# Altium schematic sheet SD_Card.SchDoc
size A4
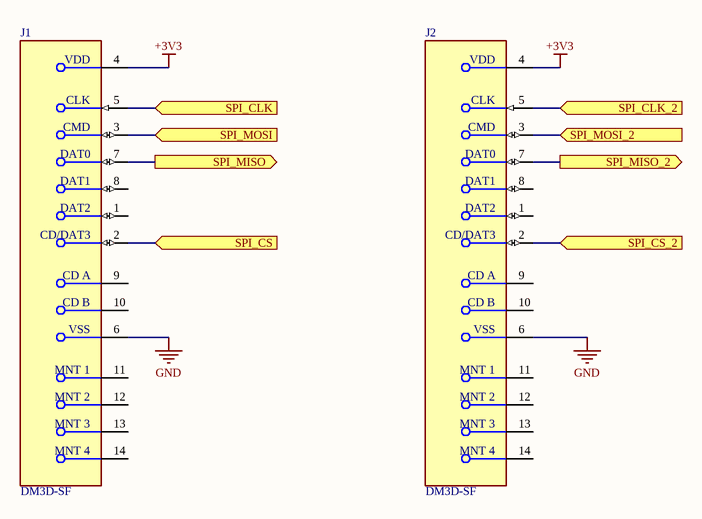
[diagram p0: SD_Card.SchDoc]

## Parts
J1  DM3D-SF  [FP-DM3D-SF-MFG]
J2  DM3D-SF  [FP-DM3D-SF-MFG]

## Ports
SPI_CLK (in), SPI_CLK_2 (in), SPI_CS (in), SPI_CS_2 (in), SPI_MISO (out), SPI_MISO_2 (out), SPI_MOSI (in), SPI_MOSI_2 (in)

## Nets
+3V3: J1.4(VDD) J2.4(VDD)
GND: J1.6(VSS) J2.6(VSS)
SPI_CLK: J1.5(CLK) ; port SPI_CLK
SPI_CLK_2: J2.5(CLK) ; port SPI_CLK_2
SPI_CS: J1.2(CD/DAT3) ; port SPI_CS
SPI_CS_2: J2.2(CD/DAT3) ; port SPI_CS_2
SPI_MISO: J1.7(DAT0) ; port SPI_MISO
SPI_MISO_2: J2.7(DAT0) ; port SPI_MISO_2
SPI_MOSI: J1.3(CMD) ; port SPI_MOSI
SPI_MOSI_2: J2.3(CMD) ; port SPI_MOSI_2

Not connected (* = marked no-connect by the designer): J1 1(DAT2) 8(DAT1) 9(CD_A) 10(CD_B) 11(MNT_1) 12(MNT_2) 13(MNT_3) 14(MNT_4); J2 1(DAT2) 8(DAT1) 9(CD_A) 10(CD_B) 11(MNT_1) 12(MNT_2) 13(MNT_3) 14(MNT_4)

## Library data of the parts
J1 J2 = CMP-2000-06166-2: CONN MICRO SD CARD PUSH-PULL; Insulation Resistance: 1GR; Max Voltage Rating (AC): 125V; Gender: Female; Contact Resistance: 100mR; Current Rating: 500mA; Pitch: 1.1mm; Connector Type: Connector; Number of Contacts: 8; Contact Plating: Gold; Number of Rows: 1; Termination: Solder; Contact Material: Copper Alloy; REACH SVHC: No SVHC; Voltage Rating (AC): 125V; Packaging: Tape and Reel; Housing Material: Polymer; Max Operating Temperature: 85°C; Package Quantity: 1; Min Operating Temperature: -25°C; Lead Free: Lead Free; Orientation: Right Angle; Radiation Hardening: No; Flammability Rating: UL94 V-0; Mount: Surface Mount; Depth: 11.45mm; Max Current Rating: 500mA; Length: 11.95mm; Width: 11.95mm